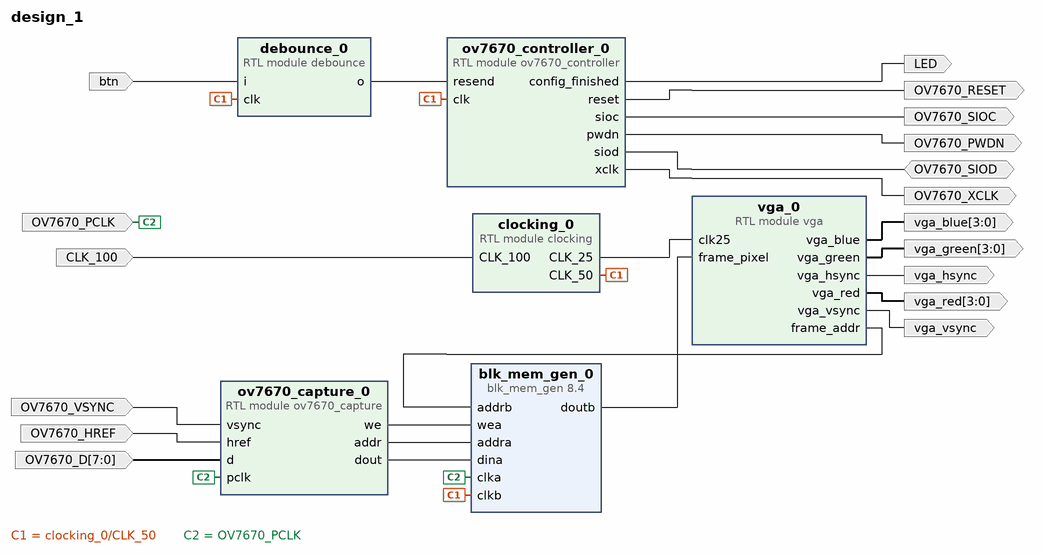
[diagram p0: block diagram of the top level]
# Vivado block design design_1, xc7z020clg484-1, Vivado 2018.3.1
create_bd_design design_1

create_bd_port -dir I CLK_100
create_bd_port -dir I btn
create_bd_port -dir O -from 3 -to 0 vga_blue
create_bd_port -dir O -from 3 -to 0 vga_green
create_bd_port -dir O -from 3 -to 0 vga_red
create_bd_port -dir O vga_hsync
create_bd_port -dir O vga_vsync
create_bd_port -dir I -type clk OV7670_PCLK
create_bd_port -dir I OV7670_VSYNC
create_bd_port -dir I OV7670_HREF
create_bd_port -dir I -from 7 -to 0 OV7670_D
create_bd_port -dir O LED
create_bd_port -dir O OV7670_SIOC
create_bd_port -dir O -type rst OV7670_RESET
create_bd_port -dir IO OV7670_SIOD
create_bd_port -dir O OV7670_PWDN
create_bd_port -dir O OV7670_XCLK

create_bd_cell -type module -reference debounce debounce_0
create_bd_cell -type module -reference vga vga_0
create_bd_cell -type module -reference ov7670_capture ov7670_capture_0
create_bd_cell -type module -reference ov7670_controller ov7670_controller_0
create_bd_cell -type module -reference clocking clocking_0
create_bd_cell -type ip -vlnv xilinx.com:ip:blk_mem_gen:8.4 blk_mem_gen_0
set_property -dict [list \
  CONFIG.Enable_32bit_Address false \
  CONFIG.Enable_A Always_Enabled \
  CONFIG.Enable_B Always_Enabled \
  CONFIG.Memory_Type Simple_Dual_Port_RAM \
  CONFIG.Operating_Mode_A NO_CHANGE \
  CONFIG.Port_B_Clock 100 \
  CONFIG.Port_B_Enable_Rate 100 \
  CONFIG.Read_Width_B 12 \
  CONFIG.Register_PortB_Output_of_Memory_Primitives true \
  CONFIG.Use_Byte_Write_Enable false \
  CONFIG.Write_Depth_A 307200 \
  CONFIG.Write_Width_A 12 \
  CONFIG.Write_Width_B 12 \
  CONFIG.use_bram_block Stand_Alone \
] [get_bd_cells blk_mem_gen_0]

# ---- connections ----

connect_bd_net -net CLK_100_0_1 [get_bd_ports CLK_100] [get_bd_pins clocking_0/CLK_100]
connect_bd_net [get_bd_pins clocking_0/CLK_50] [get_bd_pins debounce_0/clk] [get_bd_pins blk_mem_gen_0/clkb] [get_bd_pins ov7670_controller_0/clk]
connect_bd_net -net i_0_1 [get_bd_ports btn] [get_bd_pins debounce_0/i]
connect_bd_net [get_bd_pins debounce_0/o] [get_bd_pins ov7670_controller_0/resend]
connect_bd_net [get_bd_pins clocking_0/CLK_25] [get_bd_pins vga_0/clk25]
connect_bd_net [get_bd_pins vga_0/vga_blue] [get_bd_ports vga_blue]
connect_bd_net [get_bd_pins vga_0/vga_green] [get_bd_ports vga_green]
connect_bd_net [get_bd_pins vga_0/vga_red] [get_bd_ports vga_red]
connect_bd_net [get_bd_pins vga_0/vga_hsync] [get_bd_ports vga_hsync]
connect_bd_net [get_bd_pins vga_0/vga_vsync] [get_bd_ports vga_vsync]
connect_bd_net [get_bd_pins blk_mem_gen_0/doutb] [get_bd_pins vga_0/frame_pixel]
connect_bd_net [get_bd_pins vga_0/frame_addr] [get_bd_pins blk_mem_gen_0/addrb]
connect_bd_net -net clka_0_1 [get_bd_ports OV7670_PCLK] [get_bd_pins blk_mem_gen_0/clka] [get_bd_pins ov7670_capture_0/pclk]
connect_bd_net [get_bd_pins ov7670_capture_0/we] [get_bd_pins blk_mem_gen_0/wea]
connect_bd_net [get_bd_pins ov7670_capture_0/addr] [get_bd_pins blk_mem_gen_0/addra]
connect_bd_net [get_bd_pins ov7670_capture_0/dout] [get_bd_pins blk_mem_gen_0/dina]
connect_bd_net -net vsync_0_1 [get_bd_ports OV7670_VSYNC] [get_bd_pins ov7670_capture_0/vsync]
connect_bd_net -net href_0_1 [get_bd_ports OV7670_HREF] [get_bd_pins ov7670_capture_0/href]
connect_bd_net -net d_0_1 [get_bd_ports OV7670_D] [get_bd_pins ov7670_capture_0/d]
connect_bd_net [get_bd_pins ov7670_controller_0/config_finished] [get_bd_ports LED]
connect_bd_net [get_bd_pins ov7670_controller_0/sioc] [get_bd_ports OV7670_SIOC]
connect_bd_net [get_bd_pins ov7670_controller_0/reset] [get_bd_ports OV7670_RESET]
connect_bd_net [get_bd_ports OV7670_SIOD] [get_bd_pins ov7670_controller_0/siod]
connect_bd_net [get_bd_pins ov7670_controller_0/pwdn] [get_bd_ports OV7670_PWDN]
connect_bd_net [get_bd_pins ov7670_controller_0/xclk] [get_bd_ports OV7670_XCLK]

validate_bd_design
save_bd_design
